# Altium schematic sheet Sensor_Box_RGB_CTRL.SchDoc: Title
size 420 x 297 mm; Author: G.Kasprowicz; CompanyName: WUT ISE; DrawnBy: G.Kasprowicz; Organization: WUT ISE; Address1: PW ISE; Address2: Nowowiejska 15/19 00-665 Warsaw; Address3: gkasprow@gmail.com; Revision: 1.0; SheetNumber: -; SheetTotal: -; ModifiedBy: -; CheckedDate: -; Title2: Title2; DivGrp: WUT ISE; Designer: G.Kasprowicz; ModifiedDate: -; ProjectName: Sensor Box
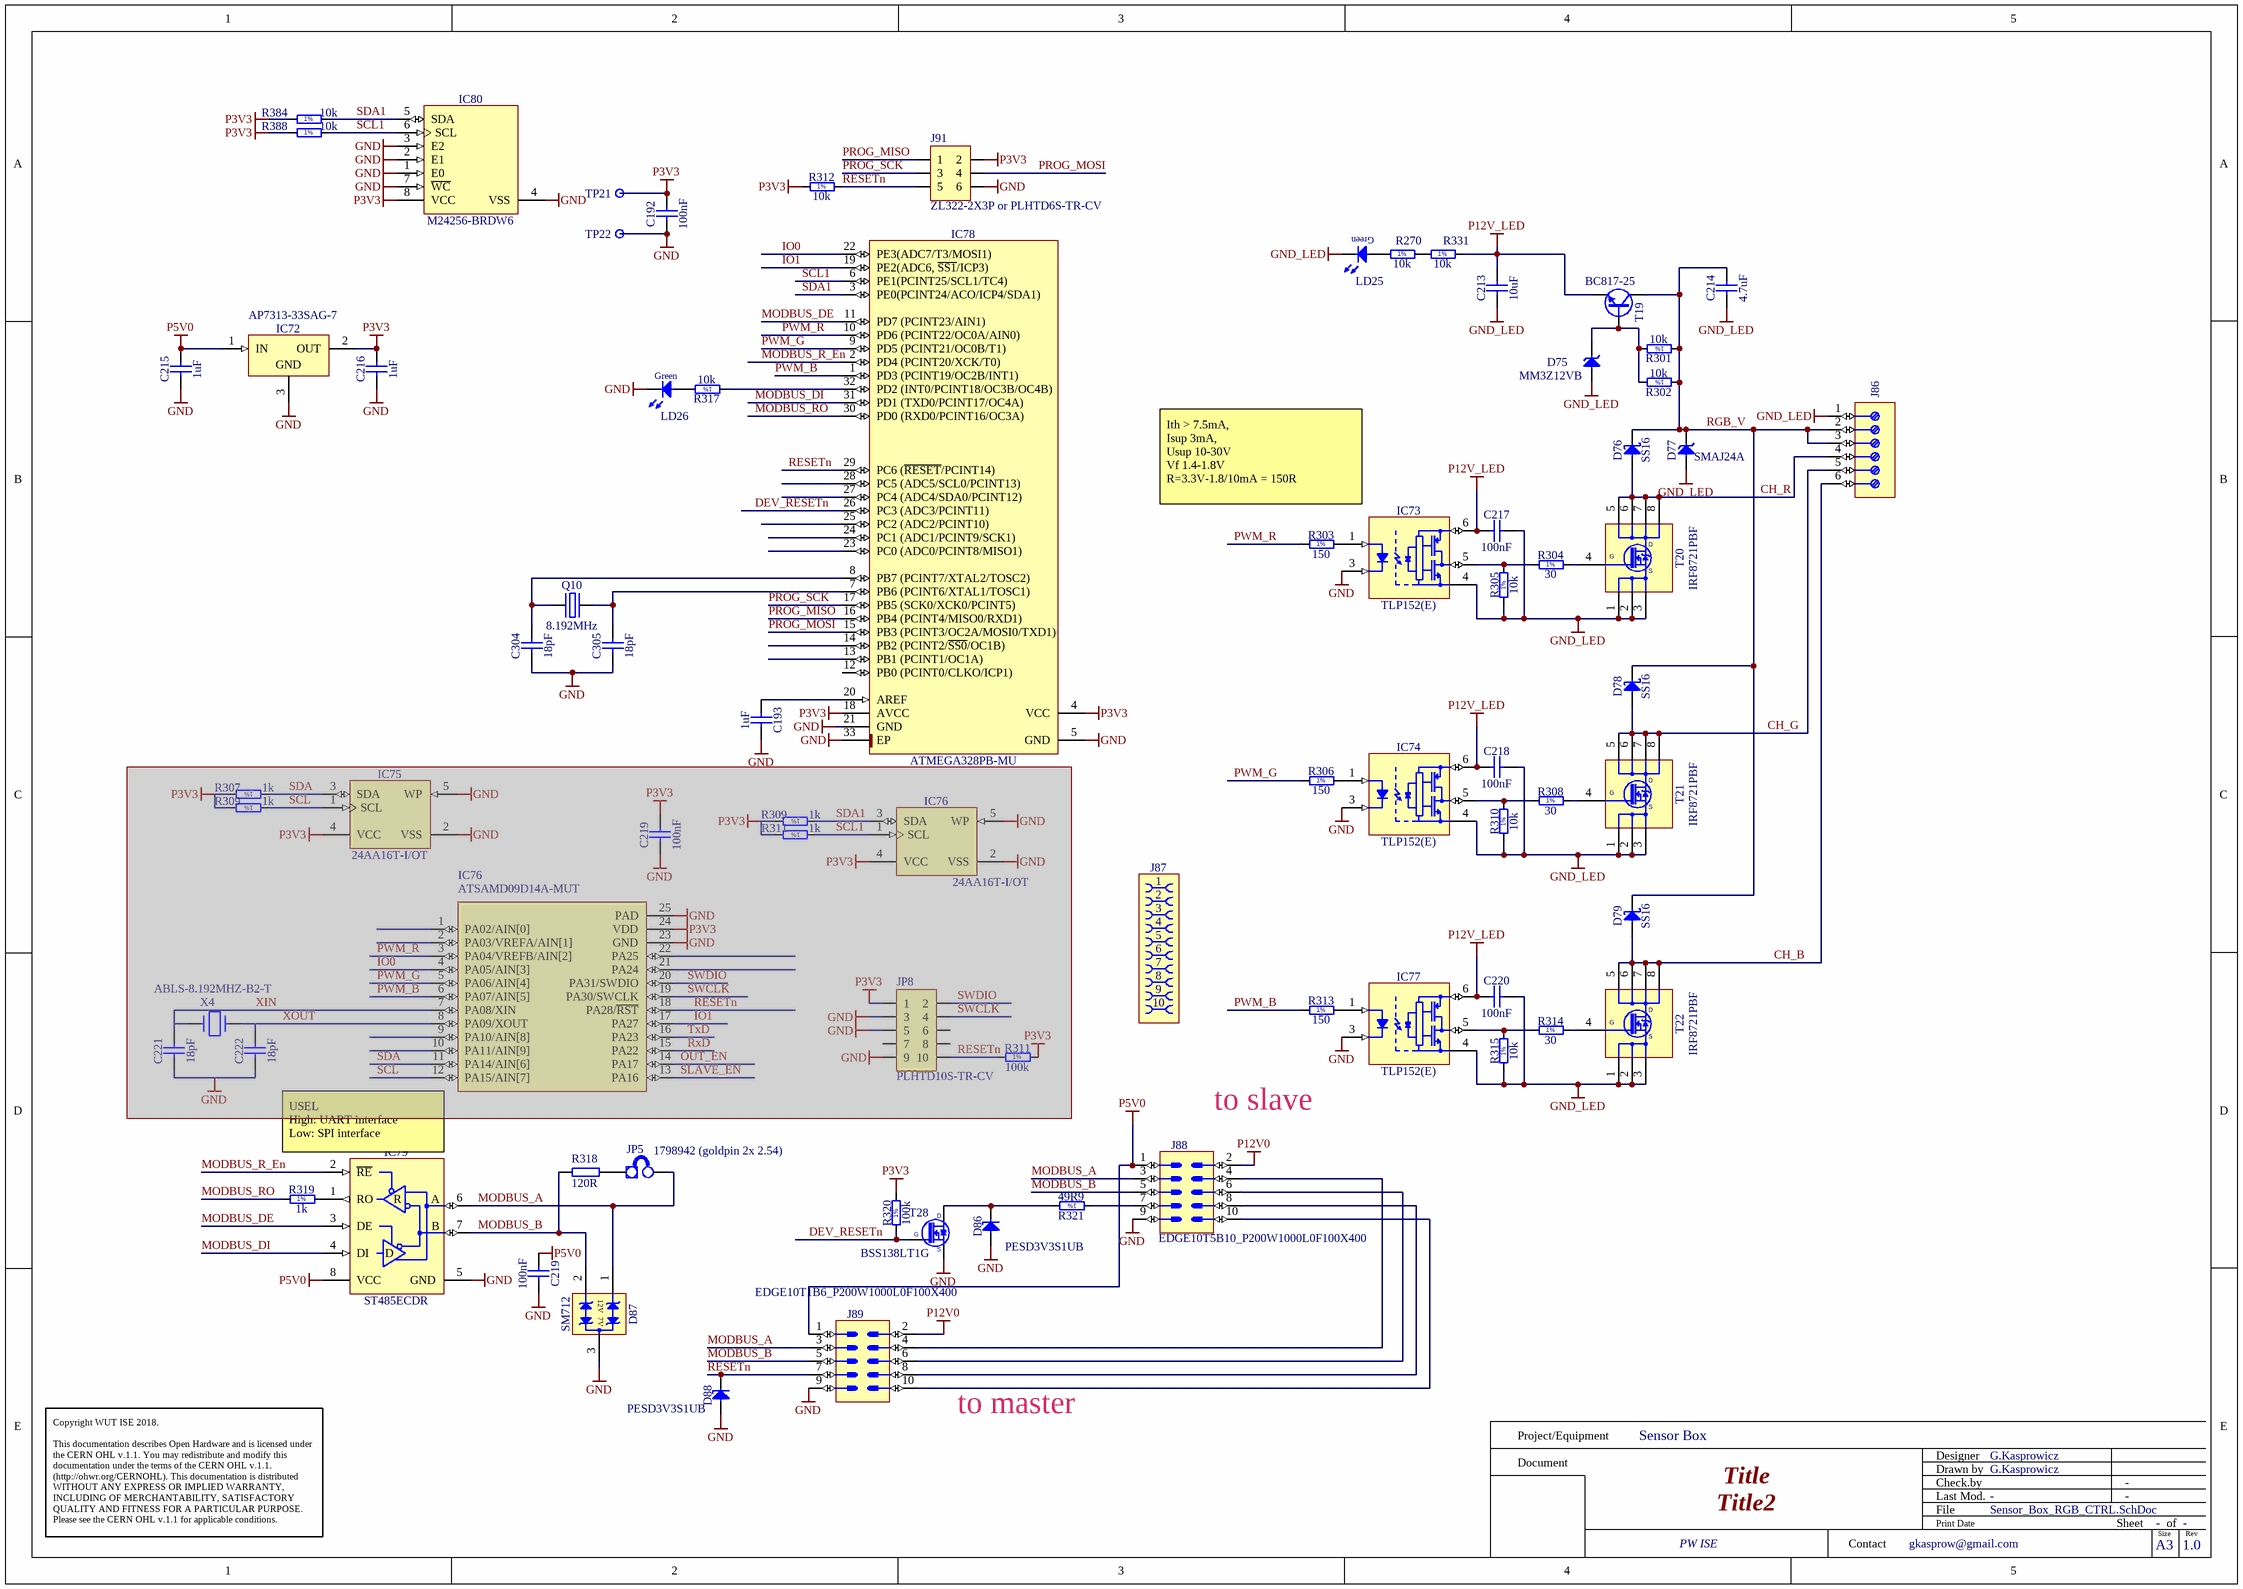
[diagram p0: Sensor_Box_RGB_CTRL.SchDoc]

## Parts
(Parts that share a designator on the sheet are numbered #1, #2 ... from top to bottom, then left to right.)
C192  100nF  [CAPC1005X55N]
C193  1uF  [CAPC1005X55N]
C213  10uF  [CAPC2012X135N]
C214  4.7uF  [CAPC1608X90N]
C215  1uF  [CAPC1005X55N]
C216  1uF  [CAPC1005X55N]
C217  100nF  [CAPC1608X87N]
C218  100nF  [CAPC1608X87N]
C219#1  100nF  [CAPC1005X55N]  (masked out: inside a compile mask, not in the netlist)
C219#2  100nF  [CAPC1005X55N]
C220  100nF  [CAPC1608X87N]
C221  18pF  [CAPC1005X55N]  (masked out: inside a compile mask, not in the netlist)
C222  18pF  [CAPC1005X55N]  (masked out: inside a compile mask, not in the netlist)
C304  18pF  [CAPC1005X55N]
C305  18pF  [CAPC1005X55N]
D75  MM3Z12VB  [SODFL2513X100N]
D76  SS16  [DIOM5127X229N]
D77  SMAJ24A  [DIOM5226X262N]
D78  SS16  [DIOM5127X229N]
D79  SS16  [DIOM5127X229N]
D86  PESD3V3S1UB  [SODFL1608X65N]
D87  SM712  [SOT95P237X112-3N]
D88  PESD3V3S1UB  [SODFL1608X65N]
IC72  AP7313-33SAG-7  [SOT95P240X130-3N]
IC73  TLP152(E)  [SOIC127P700X210-5N]
IC74  TLP152(E)  [SOIC127P700X210-5N]
IC75  24AA16T-I/OT  [SOT95P280X145-5N]  (masked out: inside a compile mask, not in the netlist)
IC76#1  24AA16T-I/OT  [SOT95P280X145-5N]  (masked out: inside a compile mask, not in the netlist)
IC76#2  ATSAMD09D14A-MUT  [QFN50P400X400X80_HS-25N]  (masked out: inside a compile mask, not in the netlist)
IC77  TLP152(E)  [SOIC127P700X210-5N]
IC78  ATMEGA328PB-MU  [QFN50P500X500X100-33N-S325]
IC79  ST485ECDR  [SOIC127P600X175-8N]
IC80  M24256-BRDW6  [SOP65P640X120-8N]
J86  (no value)  [PHOENIX_1751138]
J87  (no value)  [AVX_00 9159 010 061 916]
J88  (no value)  [EDGE10T5B10_P200W1000L0F100X400]
J89  (no value)  [EDGE10T1B6_P200W1000L0F100X400]
J91  ZL322-2X3P or PLHTD6S-TR-CV  [ZL322-2X3P]
JP5  1798942 (goldpin 2x 2.54)  [jump]
JP8  PLHTD10S-TR-CV  [PLHTD10S-TR-CV]  (masked out: inside a compile mask, not in the netlist)
LD25  Green  [LED_KINGBRIGHT_KPTR3216]  (value not drawn)
LD26  Green  [LED_KINGBRIGHT_KPH-1608CGCK]
Q10  8.192MHz  [XTAL_ABRACON_ABLS]
R270  10k  [RESC1005X40N]
R301  10k  [RESC1005X40N]
R302  10k  [RESC1005X40N]
R303  150  [RESC1608X55N]
R304  30  [RESC1608X55N]
R305  10k  [RESC1005X40N]
R306  150  [RESC1608X55N]
R307  1k  [RESC1005X40N]  (masked out: inside a compile mask, not in the netlist)
R308  30  [RESC1608X55N]
R309#1  1k  [RESC1005X40N]  (masked out: inside a compile mask, not in the netlist)
R309#2  1k  [RESC1005X40N]  (masked out: inside a compile mask, not in the netlist)
R310  10k  [RESC1005X40N]
R311#1  1k  [RESC1005X40N]  (masked out: inside a compile mask, not in the netlist)
R311#2  100k  [RESC1005X40N]  (masked out: inside a compile mask, not in the netlist)
R312  10k  [RESC1005X40N]
R313  150  [RESC1608X55N]
R314  30  [RESC1608X55N]
R315  10k  [RESC1005X40N]
R317  10k  [RESC1005X40N]
R318  120R  [1206R]
R319  1k  [RESC1005X40N]
R320  100k  [RESC1005X40N]
R321  49R9  [RESC1005X40N]
R331  10k  [RESC1005X40N]
R384  10k  [RESC1005X40N]
R388  10k  [RESC1005X40N]
T19  BC817-25  [SOT95P230X110-3N]
T20  IRF8721PBF  [SOIC127P600X175-8N]
T21  IRF8721PBF  [SOIC127P600X175-8N]
T22  IRF8721PBF  [SOIC127P600X175-8N]
T28  BSS138LT1G  [SOT95P240X110-3N]
TP21  Test Point  [TPS127]  (value not drawn)
TP22  Test Point  [TPS127]  (value not drawn)
X4  ABLS-8.192MHZ-B2-T  [HC-49SM]  (masked out: inside a compile mask, not in the netlist)

## Nets
GND: C192.1 C193.2 C215.1 C216.1 C219#2.2 C304.1 C305.1 D86.2(A) D87.3(GND) D88.2(A) IC72.3(GND) IC73.3(K) IC74.3(K) IC77.3(K) IC78.5(GND) IC78.21(GND) IC78.33(EP) IC79.5(GND) IC80.1(E0) IC80.2(E1) IC80.3(E2) IC80.4(VSS) IC80.7(~{WC}) J88.9 J89.9 J91.6 LD26.1(C) T28.2(S) TP22.1
GND_LED: C213.1 C214.1 C217.2 C218.2 C220.2 D75.2(A) D77.2(A) IC73.4(VSS) IC74.4(VSS) IC77.4(VSS) J86.1 LD25.1(C) R305.1 R310.1 R315.1 T20.1(S) T20.2(S) T20.3(S) T21.1(S) T21.2(S) T21.3(S) T22.1(S) T22.2(S) T22.3(S)
P3V3: C192.2 C216.2 IC72.2(OUT) IC78.4(VCC) IC78.18(AVCC) IC80.8(VCC) J91.2 R312.1 R320.2 R384.1 R388.1 TP21.1
P5V0: C215.2 C219#2.1 IC72.1(IN) IC79.8(VCC) J88.1 J89.1
P12V0: J88.2 J89.2
P12V_LED: C213.2 C217.1 C218.1 C220.1 IC73.6(VDD) IC74.6(VDD) IC77.6(VDD) R331.2 T19.2(E)
CH_B: D79.2(A) J86.6 T22.5(D) T22.6(D) T22.7(D) T22.8(D)
CH_G: D78.2(A) J86.5 T21.5(D) T21.6(D) T21.7(D) T21.8(D)
CH_R: D76.2(A) J86.4 T20.5(D) T20.6(D) T20.7(D) T20.8(D)
DEV_RESETn: IC78.26(PC3_(ADC3/PCINT11)) R320.1 T28.1(G)
IO0: IC78.22(PE3(ADC7/T3/MOSI1))
IO1: IC78.19(PE2(ADC6,_~{SS1}/ICP3))
MODBUS_A: D87.1(I/O1) IC79.6(A) J88.3 J89.3 JP5.2(E2)
MODBUS_B: D87.2(I/O2) IC79.7(B) J88.5 J89.5 R318.1
MODBUS_DE: IC78.11(PD7_(PCINT23/AIN1)) IC79.3(DE)
MODBUS_DI: IC78.31(PD1_(TXD0/PCINT17/OC4A)) IC79.4(DI)
MODBUS_R_En: IC78.2(PD4_(PCINT20/XCK/T0)) IC79.2(~{RE})
MODBUS_RO: IC78.30(PD0_(RXD0/PCINT16/OC3A)) R319.1
PROG_MISO: IC78.16(PB4_(PCINT4/MISO0/RXD1)) J91.1
PROG_MOSI: IC78.15(PB3_(PCINT3/OC2A/MOSI0/TXD1)) J91.4
PROG_SCK: IC78.17(PB5_(SCK0/XCK0/PCINT5)) J91.3
PWM_B: IC78.1(PD3_(PCINT19/OC2B/INT1)) R313.1
PWM_G: IC78.9(PD5_(PCINT21/OC0B/T1)) R306.1
PWM_R: IC78.10(PD6_(PCINT22/OC0A/AIN0)) R303.1
RESETn: D88.1(C) IC78.29(PC6_(~{RESET}/PCINT14)) J89.7 J91.5 R312.2
RGB_V: C214.2 D76.1(C) D77.1(C) D78.1(C) D79.1(C) J86.2 J86.3 R301.1 R302.1 T19.3(C)
SCL1: IC78.6(PE1(PCINT25/SCL1/TC4)) IC80.6(SCL) R388.2
SDA1: IC78.3(PE0(PCINT24/ACO/ICP4/SDA1)) IC80.5(SDA) R384.2
NetC193_1: C193.1 IC78.20(AREF)
NetC304_2: C304.2 IC78.8(PB7_(PCINT7/XTAL2/TOSC2)) Q10.1(OSC1)
NetC305_2: C305.2 IC78.7(PB6_(PCINT6/XTAL1/TOSC1)) Q10.2(OSC2)
NetD75_1: D75.1(C) R301.2 R302.2 T19.1(B)
NetD86_1: D86.1(C) R321.2 T28.3(D)
NetIC73_1: IC73.1(A) R303.2
NetIC73_5: IC73.5(VO1) R304.1 R305.2
NetIC74_1: IC74.1(A) R306.2
NetIC74_5: IC74.5(VO1) R308.1 R310.2
NetIC77_1: IC77.1(A) R313.2
NetIC77_5: IC77.5(VO1) R314.1 R315.2
NetIC78_32: IC78.32(PD2_(INT0/PCINT18/OC3B/OC4B)) R317.1
NetIC79_1: IC79.1(RO) R319.2
NetJ88_4: J88.4 J89.4
NetJ88_6: J88.6 J89.6
NetJ88_7: J88.7 R321.1
NetJ88_8: J88.8 J89.8
NetJ88_10: J88.10 J89.10
NetJP5_1: JP5.1(E1) R318.2
NetLD25_2: LD25.2(A) R270.1
NetLD26_2: LD26.2(A) R317.2
NetR270_2: R270.2 R331.1
NetR304_2: R304.2 T20.4(S)
NetR308_2: R308.2 T21.4(S)
NetR314_2: R314.2 T22.4(S)

Not connected (* = marked no-connect by the designer): IC78 12(PB0_(PCINT0/CLKO/ICP1)) 13(PB1_(PCINT1/OC1A)) 14(PB2_(PCINT2/~{SS0}/OC1B)) 23(PC0_(ADC0/PCINT8/MISO1)) 24(PC1_(ADC1/PCINT9/SCK1)) 25(PC2_(ADC2/PCINT10)) 27(PC4_(ADC4/SDA0/PCINT12)) 28(PC5_(ADC5/SCL0/PCINT13))

## Notes on the sheet
- Ith > 7.5mA,
  Isup 3mA,
  Usup 10-30V
  Vf 1.4-1.8V
  R=3.3V-1.8/10mA = 150R
- to slave
- USEL
  High: UART interface
  Low: SPI interface
- to master
- Project/Equipment
- Document
- Designer
- Drawn by
- Check.by
- Copyright WUT ISE 2018.
  This documentation describes Open Hardware and is licensed under the CERN OHL v.1.1. You may redistribute and modify this documentation under the terms of the CERN OHL v.1.1. (http://ohwr.org/CERNOHL). This documentation is distributed WITHOUT ANY EXPRESS OR IMPLIED WARRANTY, INCLUDING OF MERCHANTABILITY, SATISFACTORY QUALITY AND FITNESS FOR A PARTICULAR PURPOSE. Please see the CERN OHL v.1.1 for applicable conditions.
- Contact
- File
- Last Mod.
- Print Date
- Sheet
- Size
- A3
- of
- Rev
- (in symbol Q_IRF8721PBF) G
- (in symbol R0402_1K_1%_0.0625W_100PPM) 1%
- (in symbol R0402_10K_1%_0.0625W_100PPM) 1%
- (in symbol R0402_49R9_1%_0.0625W_100PPM) 1%
- (in symbol R0402_100K_1%_0.0625W_100PPM) 1%
- (in symbol R0603_30R_1%_0.1W_100PPM) 1%
- (in symbol R0603_150R_1%_0.1W_100PPM) 1%
- (in symbol SM712) 12V; 7V
- (in symbol ST485ECDR) R; D

## Library data of the parts
C192 C219#1 = CC0402_100NF_16V_10%_X5R: Non-polarised capacitor; Part Description: SMD Multilayer Chip Ceramic Capacitor; Manufacturer: GENERIC; Manufacturer1 Part Number: GRM155R61C104KA88D; Voltage: 16V; TC: X5R; Tolerance: ±10%; Part Number: CC0402_100NF_16V_10%_X5R; Component Kind: Standard; Component Type: Standard; Pin Count: 2; Value: 100nF; Status: None; Manufacturer Part Number: CC0402_100NF_16V_10%_X5R; Case: 0402; Mounted: Yes; Socket: No; SMD: Yes; Sense: No; Manufacturer1 Example: MURATA; Manufacturer1 ComponentHeight: 0.55mm; HelpURL: \\cern.ch\dfs\Applications\Altium\Datasheets\CC0402_X5R_MURATA_GRM.pdf; Author: CERN DEM JLC; CreateDate: 10.12.2013; LatestRevisionDate: 10.12.2013
C193 C215 C216 = CC0402_1UF_16V_10%_X5R: Non-polarised capacitor; Part Description: SMD Multilayer Chip Ceramic Capacitor; Manufacturer: GENERIC; Manufacturer1 Part Number: C1005X5R1C105KT; Voltage: 16V; TC: X5R; Tolerance: ±10%; Part Number: CC0402_1UF_16V_10%_X5R; Component Kind: Standard; Component Type: Standard; Pin Count: 2; Value: 1uF; Status: Preferred; Manufacturer Part Number: CC0402_1UF_16V_10%_X5R; Case: 0402; Mounted: Yes; Socket: No; SMD: Yes; Sense: No; Manufacturer1 Example: TDK; Manufacturer1 ComponentHeight: 0.55mm; HelpURL: \\cern.ch\dfs\Applications\Altium\Datasheets\CC0402_X5R_TDK_C.pdf; Author: CERN DEM JLC; CreateDate: 25.10.2012; LatestRevisionDate: 25.10.2012
C213 = CC0805_10UF_16V_10%_X5R: Non-polarised capacitor; Part Description: SMD Multilayer Chip Ceramic Capacitor; Manufacturer: GENERIC; Manufacturer1 Part Number: C0805C106K4PAC; Voltage: 16V; TC: X5R; Tolerance: ±10%; Part Number: CC0805_10UF_16V_10%_X5R; Component Kind: Standard; Component Type: Standard; Pin Count: 2; Value: 10uF; Status: Preferred; Manufacturer Part Number: CC0805_10UF_16V_10%_X5R; Case: 0805; Mounted: Yes; Socket: No; SMD: Yes; Sense: No; Manufacturer1 Example: KEMET; Manufacturer1 ComponentHeight: 1.4mm; HelpURL: \\cern.ch\dfs\Applications\Altium\Datasheets\CC1206_X5R_KEMET.pdf; Author: CERN DEM JLC; CreateDate: 03.12.2007; LatestRevisionDate: 03.12.2007
C214 = CC0603_4.7UF_25V_10%_X5R: Non-polarised capacitor; Part Description: SMD Multilayer Chip Ceramic Capacitor; Manufacturer: GENERIC; Manufacturer1 Part Number: GRM188R61E475KE11D; Voltage: 25V; TC: X5R; Tolerance: ±10%; Part Number: CC0603_4.7UF_25V_10%_X5R; Component Kind: Standard; Component Type: Standard; Pin Count: 2; Value: 4.7uF; Status: None; Manufacturer Part Number: CC0603_4.7UF_25V_10%_X5R; Case: 0603; Mounted: Yes; Socket: No; SMD: Yes; Sense: No; Manufacturer1 Example: MURATA; Manufacturer1 ComponentHeight: 0.95mm; HelpURL: \\cern.ch\dfs\Applications\Altium\Datasheets\CC0603_MURATA_GRM188R61E475KE11D.pdf; Author: CERN DEM JLC; CreateDate: 10.11.2014; LatestRevisionDate: 10.11.2014
C217 C218 C220 = CC0603_100NF_50V_10%_X5R: Non-polarised capacitor; Part Description: SMD Multilayer Chip Ceramic Capacitor; Manufacturer: GENERIC; Manufacturer1 Part Number: C1608X5R1H104K080AA; Voltage: 50V; TC: X5R; Tolerance: ±10%; Part Number: CC0603_100NF_50V_10%_X5R; Component Kind: Standard; Component Type: Standard; Pin Count: 2; Value: 100nF; Status: None; Manufacturer Part Number: CC0603_100NF_50V_10%_X5R; Case: 0603; Mounted: Yes; Socket: No; SMD: Yes; Sense: No; Manufacturer1 Example: TDK; Manufacturer1 ComponentHeight: 0.9mm; HelpURL: \\cern.ch\dfs\Applications\Altium\Datasheets\CC0603_X5R_TDK_C.pdf; Author: CERN DEM MR; CreateDate: 08.01.2016; LatestRevisionDate: 08.01.2016
C219#2 = CC0402_100NF_16V_10%_X7R: Non-polarised capacitor; Part Description: SMD Multilayer Chip Ceramic Capacitor; Manufacturer: GENERIC; Manufacturer1 Part Number: GRM155R71C104KA88D; Voltage: 16V; TC: X7R; Tolerance: ±10%; Part Number: CC0402_100NF_16V_10%_X7R; Component Kind: Standard; Component Type: Standard; Pin Count: 2; Value: 100nF; Status: Not Recommended; Manufacturer Part Number: CC0402_100NF_16V_10%_X7R; Case: 0402; Mounted: Yes; Socket: No; SMD: Yes; Manufacturer1 Example: MURATA; Manufacturer1 ComponentHeight: 0.55mm; HelpURL: \\cern.ch\dfs\Applications\Altium\Datasheets\CC0402_X7R_MURATA_GRM.pdf; Author: CERN DEM JLC; CreateDate: 05.12.2013; LatestRevisionDate: 03.12.2007; Sense: No
C221 C222 C304 C305 = CC0402_18PF_50V_5%_C0G: Non-polarised capacitor; Part Description: SMD Multilayer Chip Ceramic Capacitor; Manufacturer: GENERIC; Manufacturer1 Part Number: C0402C180J5GACTU; Voltage: 50V; TC: C0G/NP0; Tolerance: ±5%; Part Number: CC0402_18PF_50V_5%_C0G; Component Kind: Standard; Component Type: Standard; Pin Count: 2; Value: 18pF; Status: Preferred; Manufacturer Part Number: CC0402_18PF_50V_5%_C0G; Case: 0402; Mounted: Yes; Socket: No; SMD: Yes; Sense: No; Manufacturer1 Example: KEMET; Manufacturer1 ComponentHeight: 0.55mm; HelpURL: \\cern.ch\dfs\Applications\Altium\Datasheets\CC0805_C0G_KEMET_(Commercial Grade).pdf; Author: CERN DEM JLC; CreateDate: 04.10.2016; LatestRevisionDate: 04.10.2016
D75 = MM3Z12VB: Zener Diode; Part Description: Zener Voltage Regulator; Manufacturer: ON SEMICONDUCTOR; Voltage: 12V; Power: 200mW; PressFit: No; Bonding: No; Part Number: MM3Z12VB; Component Kind: Standard; Component Type: Standard; Device: MM3Z12VB; PackageDescription: SODFL Diode (SOD-323F), 1.70mm W X 1.30mm L X 1.00mm H body, IPC Medium Density; Manufacturer Part Number: MM3Z12VB; Pin Count: 2; Case: SOD-323F; Mounted: Yes; Socket: No; SMD: Yes; Sense: No; ComponentHeight: 1mm; HelpURL: \\cern.ch\dfs\Applications\Altium\Datasheets\MM3Z12VB.pdf; Author: CERN DEM MR; CreateDate: 19.02.2018; LatestRevisionDate: 19.02.2018
D76 D78 D79 = SS16: Schottky Diode; Part Description: Surface Mount Schottky Barrier Rectifier; Manufacturer: VISHAY GENERAL SEMICONDUCTOR; Voltage: 60V; Power: 1A; PressFit: No; Bonding: No; Part Number: SS16; Component Kind: Standard; Component Type: Standard; Device: SS16; PackageDescription: DO-214-AC Molded Diode, Body 5.1x2.7mm, IPC Medium Density; Manufacturer Part Number: SS16; Pin Count: 2; Case: DO-214AC; Mounted: Yes; Socket: No; SMD: Yes; Sense: No; ComponentHeight: 2.29mm; HelpURL: \\cern.ch\dfs\Applications\Altium\Datasheets\SS16.pdf; Author: CERN DEM JLC; CreateDate: 15.07.2008; LatestRevisionDate: 23.08.2010
D77 = SMAJ24A: Transient Voltage Suppressor Diode (Uni-Directional); Part Description: Surface Mount Uni-directional Transient Voltage Suppressor Diode; Manufacturer: BOURNS; Voltage: 24V; Power: 400W; PressFit: No; Bonding: No; Part Number: SMAJ24A; Component Kind: Standard; Component Type: Standard; Device: SMAJ24A; PackageDescription: DO-214-AC/SMA Diode, Molded Body; 5.21mm L X 2.605mm W X 2.62mm H, IPC Medium Density; Manufacturer Part Number: SMAJ24A; Pin Count: 2; Case: DO-214AC; Mounted: Yes; Socket: No; SMD: Yes; Sense: No; ComponentHeight: 2.62mm; HelpURL: \\cern.ch\dfs\Applications\Altium\Datasheets\SMAJ24A.pdf; Author: CERN DEM JLC; CreateDate: 27.06.2011; LatestRevisionDate: 27.06.2011
D86 D88 = PESD3V3S1UB: ESD protection diode; Part Description: ESD protection diode (23kV); Manufacturer: NXP SEMICONDUCTORS; Voltage: 3V3; Power: 330W; PressFit: No; Bonding: No; Part Number: PESD3V3S1UB; Component Kind: Standard; Component Type: Standard; Device: PESD3V3S1UB; PackageDescription: Ultra Small Outline Diode Flat Lead (SOD-523), Body; 1.2mm L X 0.8mm W X 0.65mm H, IPC Medium Density; Manufacturer Part Number: PESD3V3S1UB; Pin Count: 2; Case: SOD523; Mounted: Yes; Socket: No; SMD: Yes; Sense: No; ComponentHeight: 0.65mm; HelpURL: \\cern.ch\dfs\Applications\Altium\Datasheets\PESD3V3S1UB.pdf; Author: CERN DEM JLC; CreateDate: 29.11.2012; LatestRevisionDate: 29.11.2012
D87 = SM712: Asymmetrical TVS Diode for Extended Common-Mode RS-485; Manufacturer: SEMTECH; Voltage: 12V/-7V; Power: 400W; PressFit: No; Bonding: No; Part Number: SM712; Component Kind: Standard; Component Type: Standard; Device: SM712; PackageDescription: SOT, 0.95mm, pitch; 3 pin,1.30mm W X 2.92mm L X 1.12mm H body, IPC Medium Density; Status: Obsolete; Part Description: Asymmetrical TVS Diode for Extended Common-Mode RS-485; Manufacturer Part Number: SM712; Pin Count: 3; Case: SOT-23; Mounted: Yes; Socket: No; SMD: Yes; Sense: No; ComponentHeight: 1.12mm; HelpURL: \\cern.ch\dfs\Applications\Altium\Datasheets\SM712.pdf; Author: CERN DEM JLC; CreateDate: 23.04.2012; LatestRevisionDate: 23.04.2012
IC72 = AP7313-33SAG-7: 3-Terminal Regulator 1=IN 2=OUT 3=GND; Part Description: 3.3V, 150mA Low Quiescent Current, Fast Transient Low Dropout Linear Regulator; Manufacturer: DIODES INCORPORATED; PressFit: No; Bonding: No; Part Number: AP7313-33SAG-7; Component Kind: Standard; Component Type: Standard; Device: AP7313-33SAG-7; PackageDescription: SOT23 3-Leads, Pitch 0.95mm - Body 1.3x2.9mm, IPC Medium Density; Manufacturer Part Number: AP7313-33SAG-7; Pin Count: 3; Case: SOT23; Mounted: Yes; Socket: No; SMD: Yes; Sense: No; ComponentHeight: 1.35mm; HelpURL: \\cern.ch\dfs\Applications\Altium\Datasheets\AP7313-33SAG-7.pdf; Author: CERN DEM JLC; CreateDate: 20.03.2018; LatestRevisionDate: 20.03.2018
IC73 IC74 IC77 = OPTO_TLP152: Optocoupler; Part Description: 2.5A Output Current, High Speed MOSFET Gate Driver Optocoupler; Manufacturer: Toschiba; PressFit: No; Bonding: No; Part Number: TLP152(E); Component Kind: Standard; Component Type: Standard; Device: TLP152(E); PackageDescription: SOIC, 5-Leads, Body 3.70x4.55mm, Pitch 1.27mm, IPC Medium Density; Manufacturer Part Number: TLP152(E); Pin Count: 5; Case: SOIC5; Mounted: Yes; Socket: No; SMD: Yes; Sense: No; ComponentHeight: 5.08mm; HelpURL: \\cern.ch\dfs\Applications\Altium\Datasheets\FOD3182SDV.pdf; Author: GK; CreateDate: 20.10.2014; LatestRevisionDate: 20.10.2014
IC75 IC76#1 = MEM_24AA16T_SOT23: 1.7V-5.5V, 2K I2C Serial EEPROM With EUI-48 Node Identity; Part Description: 1.7V-5.5V, 16K I2C Serial EEPROM; Manufacturer: MICROCHIP TECHNOLOGY; PressFit: No; Bonding: No; Part Number: 24AA16T-I/OT; Component Kind: Standard; Component Type: Standard; Device: 24AA16T-I/OT; PackageDescription: SOT, 0.95mm pitch; 5 pin, 1.60mm W X 2.90mm L X 1.45mm H body, IPC Medium Density; Manufacturer Part Number: 24AA16T-I/OT; Pin Count: 5; Case: SOT23-5; Mounted: Yes; Socket: No; SMD: Yes; Sense: No; ComponentHeight: 1.45mm; HelpURL: \\cern.ch\dfs\Applications\Altium\Datasheets\24AA02E48T-I-OT.pdf; Author: GK; CreateDate: 31.03.2016; LatestRevisionDate: 31.03.2016
IC76#2 = UPC_ATSAMD09D: 32-bit ARM®-based Cortex®-M4 core Microcontroller, 1.62V to 3.6V, 120MHz, 256KB Flash, 64KB of SRAM, 48 QFP, Industrial Grade (-40°C to 85°C); Part Description: ATSAMD09D14A-MUT  SMART SAMD09, SMART ARM based Microcontrollers, 32 bity, 48 MHz, 16 KB, 4 KB; Manufacturer: Microchip; PressFit: No; Bonding: No; Part Number: ATSAMD09D14A-MUT; Component Kind: Standard; Component Type: Standard; Device: ATSAMD09D14A-MUT; PackageDescription: QFN, 24-Leads, Body 4.00x4.00mm, Pitch 0.50mm, Thermal Pad 2.60x2.60mm, IPC Medium Density; Manufacturer Part Number: ATSAMD09D14A-MUT; Pin Count: 24; Case: QFN24; Mounted: Yes; Socket: No; SMD: Yes; Sense: No; ComponentHeight: 1.6mm; HelpURL: \\cern.ch\dfs\Applications\Altium\Datasheets\ATSAM4S4AA-AU.pdf; Author: GK; CreateDate: 16.12.2017; LatestRevisionDate: 16.12.2017
IC78 = UPC_ATMEGA328PB-MU: 8-bit AVR 20MHz Microcontroller With 32K Bytes In-System  Programmable  Flash; Part Description: 8-bit AVR Microcontroller, 32KB Flash, 1KB EEPROM, 2KB SRAM, 32-pin MLF, Industrial Grade (-40°C to 85°C); Manufacturer: ATMEL; PressFit: No; Bonding: No; Part Number: ATMEGA328PB-MU; Component Kind: Standard; Component Type: Standard; Device: ATMEGA328PB-MU; PackageDescription: QFN, (MO-220-VHHD-2) 0.50mm pitch,square; 8 pin X 8 pin, 5mm X 5mm X 1.00mm H body (w/thermal tab 3.25 X 3.25mm),  IPC Medium Density; Manufacturer Part Number: ATMEGA328PB-MU; Pin Count: 33; Case: QFN32; Mounted: Yes; Socket: No; SMD: Yes; Sense: No; ComponentHeight: 1mm; HelpURL: \\cern.ch\dfs\Applications\Altium\Datasheets\ATMEGA328P-MU.pdf; Author: GK; CreateDate: 2011-02-08; LatestRevisionDate: 2014-07-02
IC79 = ST485ECDR: ±15kV ESD-Protected, Low Power  RS-485/RS-422 Transceiver; Manufacturer: ST MICROELECTRONICS; PressFit: No; Bonding: No; Part Number: ST485ECDR; Component Kind: Standard; Component Type: Standard; Device: ST485ECDR; PackageDescription: SOIC 8, Pitch 1.27mm - Body 4x5mm, IPC Medium Density; Part Description: ±15kV ESD-Protected, Low Power  RS-485/RS-422 Transceiver; Manufacturer Part Number: ST485ECDR; Pin Count: 8; Case: SOIC8; Mounted: Yes; Socket: No; SMD: Yes; Sense: No; ComponentHeight: 1.75mm; Author: CERN DEM MR; HelpURL: \\cern.ch\dfs\Applications\Altium\Datasheets\ST485ECDR.pdf; CreateDate: 15.02.2018; LatestRevisionDate: 15.02.2018
IC80 = MEM_M24256-BRDW6P: 256-Kbit Serial I²C Bus EEPROM; Manufacturer: ST MICROELECTRONICS; PressFit: No; Bonding: No; Part Number: M24256-BRDW6P; Component Kind: Standard; Component Type: Standard; Device: M24256-BRDW6; PackageDescription: SOP, 0.65mm pitch; 8 pin, 4.40mm W X 3.00mm L X 1.20mm H body, IPC Medium Density; Part Description: 256-Kbit Serial I²C Bus EEPROM; Manufacturer Part Number: M24256-BRDW6; Pin Count: 8; Case: TSSOP8; Mounted: Yes; Socket: No; SMD: Yes; Sense: No; ComponentHeight: 1.2mm; HelpURL: \\cern.ch\dfs\Applications\Altium\Datasheets\M24256-BRDW6P.pdf; Author: CERN DEM MR; CreateDate: 17.03.2016; LatestRevisionDate: 17.03.2016
J86 = PHOENIX_1751138: Terminal Block, 6 Positions, Screw Connection; Part Description: 10A 200V PCB Terminal Block, Pitch 3.5mm, 6 Positions, Screw Connection (Conductor/PCB connection direction: 55°); Manufacturer: PHOENIX CONTACT; Manufacturer Part Number: 1751138 (SMKDS 1/ 6-3,5); PressFit: No; Part Number: PHOENIX_1751138; Component Kind: Standard; Component Type: Standard; Pin Count: 6; Mounted: Yes; Socket: No; SMD: No; Sense: No; Status: None; ComponentHeight: 9.5mm; HelpURL: \\cern.ch\dfs\Applications\Altium\Datasheets\PHOENIX_1751138.pdf; Author: CERN DEM JLC; CreateDate: 31.03.2015; LatestRevisionDate: 31.03.2015
J87 = AVX_00 9159 010 061 916: Open Ended Card Edge Connector, 9159 Series; Part Description: 10 Contacts, 2mm Pitch, Open Ended Card Edge Connector, 9159 Series; Manufacturer: AVX; PressFit: No; Part Number: AVX_00 9159 010 061 916; Component Kind: Standard; Component Type: Standard; Pin Count: 10; Mounted: Yes; Socket: No; SMD: No; Sense: No; Status: None; Manufacturer Part Number: 00 9159 010 061 916; ComponentHeight: 1.6mm; HelpURL: \\cern.ch\dfs\Applications\Altium\Datasheets\AVX_00 9159 010 061 916.pdf; Author: CERN DEM MR; CreateDate: 13.02.2018; LatestRevisionDate: 13.02.2018
J88 = EDGE10T5B10_P200W1000L0F100X400: PCB Edge Connector 10 (2x5); Part Description: 10 Contacts Board Edge Connector, Pitch 2mm, Length 0mm, Width 10mm, Finger Lenght 4mm, Finger Width 1mm; Mounted: No; PressFit: No; Part Number: EDGE10T5B10_P200W1000L0F100X400; Component Kind: Standard (No BOM); Component Type: Standard (No BOM); Pin Count: 10; Socket: No; SMD: No; Sense: No; Status: None; ComponentHeight: 0mm; HelpURL: \\cern.ch\dfs\Applications\Altium\Datasheets\EDGE10T5B10_P200W1000L0F100X400.pdf; Author: CERN DEM MR; CreateDate: 14.02.2018; LatestRevisionDate: 14.02.2018
J89 = EDGE10T1B6_P200W1000L0F100X400: PCB Edge Connector 10 (2x5); Part Description: 10 Contacts Board Edge Connector, Pitch 2mm, Length 0mm, Width 10mm, Finger Lenght 4mm, Finger Width 1mm; Mounted: No; PressFit: No; Part Number: EDGE10T1B6_P200W1000L0F100X400; Component Kind: Standard (No BOM); Component Type: Standard (No BOM); Pin Count: 10; Socket: No; SMD: No; Sense: No; Status: None; ComponentHeight: 0mm; HelpURL: \\cern.ch\dfs\Applications\Altium\Datasheets\EDGE10T1B6_P200W1000L0F100X400.pdf; Author: CERN DEM MR; CreateDate: 14.02.2018; LatestRevisionDate: 14.02.2018
J91 = CON_2x3 1.27 SMT Male: 1.27 mm dual row goldpin (Maritex)
JP5 = JUMPER: Supplier 1: Farnell; Supplier Part Number 1: 1798942
JP8 = CON_2x5 1.27 SMT Male: 1.27 mm dual row goldpin (Maritex)
LD25 = LED_KINGBRIGHT_KPTR-3216CGCK: LED Green 1A 2C; Part Description: Reverse Mount LED 1.4x1.6mm Green; PressFit: No; Bonding: No; Part Number: LED_KINGBRIGHT_KPTR-3216CGCK; Component Kind: Standard; Component Type: Standard; Color: Green; PackageDescription: Reverse Mount LED 3216, Hole 2.1x2.3mm 0.35mm Height; Manufacturer: KINGBRIGHT; Manufacturer Part Number: KPTR-3216CGCK; Pin Count: 2; Mounted: Yes; Socket: No; SMD: Yes; Sense: No; ComponentHeight: 0.35mm; HelpURL: \\cern.ch\dfs\Applications\Altium\Datasheets\LED_KINGBRIGHT_KPTR-3216CGCK.pdf; Author: CERN DEM MR; CreateDate: 15.02.2016; LatestRevisionDate: 15.02.2016
LD26 = LED_KINGBRIGHT_KPH-1608CGCK: LED Green 1C 2A; Part Description: SMD Green LED, Case 1.6mmX0.8mm(0603), 0.65mm Thickness; PressFit: No; Bonding: No; Part Number: LED_KINGBRIGHT_KPH-1608CGCK; Component Kind: Standard; Component Type: Standard; Color: Green; PackageDescription: SMT Green LED, Case 0603, Body L 1.6 x W 0.8mm H 0.65mm; Manufacturer: KINGBRIGHT; Manufacturer Part Number: KPH-1608CGCK; Pin Count: 2; Mounted: Yes; Socket: No; SMD: Yes; Sense: No; ComponentHeight: 0.65mm; HelpURL: \\cern.ch\dfs\Applications\Altium\Datasheets\LED_KINGBRIGHT_KPH-1608CGCK.pdf; Author: CERN DEM JLC; CreateDate: 03.07.2017; LatestRevisionDate: 03.07.2017
Q10 = XTAL_8.192MHZ_ABRACON_ABLS-8.192MHZ-B2-T: Quartz Crystal; Part Description: Tolerance: ± 20ppm, Stability: ± 50ppm, -20°C to +70°C, 18pF, 80 Ohms ESR, Low Profile Surface Mount Microprocessor Crystal, ABLS Series; PressFit: No; Bonding: No; Part Number: XTAL_8.192MHZ_ABRACON_ABLS-8.192MHZ-B2-T; Component Kind: Standard; Component Type: Standard; PackageDescription: SMD Crystal, Body 11.40mm L X 4.70mm W X 4.20mm H, HC/49US (AT49) ALBS Series; Value: 8.192MHz; Manufacturer: ABRACON; Manufacturer Part Number: ABLS-8.192MHZ-B2-T; Pin Count: 2; Mounted: Yes; Socket: No; SMD: Yes; Sense: No; ComponentHeight: 4.2mm; HelpURL: \\cern.ch\dfs\Applications\Altium\Datasheets\XTAL_ABRACON_ABLS.pdf; Author: CERN DEM MR; CreateDate: 15.02.2018; LatestRevisionDate: 15.02.2018
R270 R301 R302 R305 R310 R312 R315 R317 R331 R384 R388 = R0402_10K_1%_0.0625W_100PPM: Resistor - 1%; Part Description: General Purpose Thick Film Chip Resistor; Manufacturer: GENERIC; Manufacturer1 Part Number: 232270671003L; TC: ±100ppm/°C; PressFit: No; Part Number: R0402_10K_1%_0.0625W_100PPM; Component Kind: Standard; Component Type: Standard; Pin Count: 2; Value: 10k; Status: Not Recommended; Power: 0.0625W; Tolerance: ±1%; Manufacturer Part Number: R0402_10K_1%_0.0625W_100PPM; Case: 0402; Mounted: Yes; Sense: No; Socket: No; SMD: Yes; Manufacturer1 Example: YAGEO PHYCOMP; Manufacturer1 ComponentHeight: 0.4mm; HelpURL: \\cern.ch\dfs\Applications\Altium\Datasheets\R0402_Phycomp_RC0402.pdf; Author: CERN DEM JLC; CreateDate: 03.12.2007; LatestRevisionDate: 17.10.2012
R303 R306 R313 = R0603_150R_1%_0.1W_100PPM: Resistor - 1%; Part Description: General Purpose Thick Film Chip Resistor; Manufacturer: GENERIC; Manufacturer1 Part Number: NRC06F1500TRF; Power: 0.1W; TC: ±100ppm/°C; PressFit: No; Part Number: R0603_150R_1%_0.1W_100PPM; Component Kind: Standard; Component Type: Standard; Pin Count: 2; Value: 150; Status: Preferred; Tolerance: ±1%; Manufacturer Part Number: R0603_150R_1%_0.1W_100PPM; Case: 0603; Mounted: Yes; Sense: No; Socket: No; SMD: Yes; Manufacturer1 Example: NIC COMPONENT; Manufacturer1 ComponentHeight: 0.55mm; HelpURL: \\cern.ch\dfs\Applications\Altium\Datasheets\R0603_NIC_NRC.pdf; Author: CERN DEM JLC; CreateDate: 03.12.2007; LatestRevisionDate: 13.03.2008
R304 R308 R314 = R0603_30R_1%_0.1W_100PPM: Resistor - 1%; Part Description: General Purpose Thick Film Chip Resistor; Manufacturer: GENERIC; Manufacturer1 Part Number: NRC06F30R0TRF; Power: 0.1W; TC: ±100ppm/°C; PressFit: No; Part Number: R0603_30R_1%_0.1W_100PPM; Component Kind: Standard; Component Type: Standard; Pin Count: 2; Value: 30; Status: Preferred; Tolerance: ±1%; Manufacturer Part Number: R0603_30R_1%_0.1W_100PPM; Case: 0603; Mounted: Yes; Sense: No; Socket: No; SMD: Yes; Manufacturer1 Example: NIC COMPONENT; Manufacturer1 ComponentHeight: 0.55mm; HelpURL: \\cern.ch\dfs\Applications\Altium\Datasheets\R0603_NIC_NRC.pdf; Author: CERN DEM JLC; CreateDate: 03.12.2007; LatestRevisionDate: 13.03.2008
R307 R309#1 R309#2 R311#1 R319 = R0402_1K_1%_0.0625W_100PPM: Resistor - 1%; Part Description: General Purpose Thick Film Chip Resistor; Manufacturer: GENERIC; Manufacturer1 Part Number: 232270671002L; TC: ±100ppm/°C; PressFit: No; Part Number: R0402_1K_1%_0.0625W_100PPM; Component Kind: Standard; Component Type: Standard; Pin Count: 2; Value: 1k; Status: Not Recommended; Power: 0.0625W; Tolerance: ±1%; Manufacturer Part Number: R0402_1K_1%_0.0625W_100PPM; Case: 0402; Mounted: Yes; Sense: No; Socket: No; SMD: Yes; Manufacturer1 Example: YAGEO PHYCOMP; Manufacturer1 ComponentHeight: 0.4mm; HelpURL: \\cern.ch\dfs\Applications\Altium\Datasheets\R0402_Phycomp_RC0402.pdf; Author: CERN DEM JLC; CreateDate: 03.12.2007; LatestRevisionDate: 17.10.2012
R311#2 R320 = R0402_100K_1%_0.0625W_100PPM: Resistor - 1%; Part Description: General Purpose Thick Film Chip Resistor; Manufacturer: GENERIC; Manufacturer1 Part Number: 232270671004L; TC: ±100ppm/°C; PressFit: No; Part Number: R0402_100K_1%_0.0625W_100PPM; Component Kind: Standard; Component Type: Standard; Pin Count: 2; Value: 100k; Status: Not Recommended; Power: 0.0625W; Tolerance: ±1%; Manufacturer Part Number: R0402_100K_1%_0.0625W_100PPM; Case: 0402; Mounted: Yes; Sense: No; Socket: No; SMD: Yes; Manufacturer1 Example: YAGEO PHYCOMP; Manufacturer1 ComponentHeight: 0.4mm; HelpURL: \\cern.ch\dfs\Applications\Altium\Datasheets\R0402_Phycomp_RC0402.pdf; Author: CERN DEM JLC; CreateDate: 03.12.2007; LatestRevisionDate: 17.10.2012
R318 = RES_1206: SMD Resistor; Supplier 1: Newark; Supplier Part Number 1: 39K0871
R321 = R0402_49R9_1%_0.0625W_100PPM: Resistor - 1%; Part Description: General Purpose Thick Film Chip Resistor; Manufacturer: GENERIC; Manufacturer1 Part Number: 232270674999L or RC0402FR-0749R9L; TC: ±100ppm/°C; Table: Resistors SMD; Part Number: R0402_49R9_1%_0.0625W_100PPM; Component Kind: Standard; Component Type: Standard; Pin Count: 2; Value: 49R9; Status: Not recommended; Power: 0.0625W; Tolerance: ±1%; Manufacturer Part Number: R0402_49R9_1%_0.0625W_100PPM; Case: 0402; Mounted: Yes; Socket: No; SMD: Yes; Manufacturer1 Example: YAGEO PHYCOMP; Manufacturer1 ComponentHeight: 0.4mm; HelpURL: \\cern.ch\dfs\Applications\Altium\Datasheets\R0402_Phycomp_RC0402.pdf; Author: CERN DEM JLC; CreateDate: 2012-10-24; LatestRevisionDate: 2012-10-24
T19 = BC817-25: NPN Transistor; Part Description: 45V 500mA NPN General-Purpose Transistor; Manufacturer: NXP SEMICONDUCTORS; PressFit: No; Bonding: No; Part Number: BC817-25; Component Kind: Standard; Component Type: Standard; Device: BC817-25; PackageDescription: SOT23, 3 pin, Pitch 0.95mm - 1.3mm W X 2.9mm L X 1.1mm H, IPC Medium Density; Manufacturer Part Number: BC817-25; Pin Count: 3; Case: SOT23-3; Mounted: Yes; Socket: No; SMD: Yes; Sense: No; ComponentHeight: 1.1mm; HelpURL: \\cern.ch\dfs\Applications\Altium\Datasheets\BC817-25.pdf; Author: CERN DEM JLC; CreateDate: 28.10.2014; LatestRevisionDate: 28.10.2014
T20-T22 = Q_IRF8721PBF: 30V 11A N-Channel HEXFET® Power MOSFET; Manufacturer: INTERNATIONAL RECTIFIER; PressFit: No; Bonding: No; Part Number: IRF8721PBF; Component Kind: Standard; Component Type: Standard; Device: IRF8721PBF; PackageDescription: SOIC 8, Pitch 1.27mm - Body 4x5mm, IPC Medium Density; Part Description: 30V 11A N-Channel HEXFET® Power MOSFET; Manufacturer Part Number: IRF8721PBF; Pin Count: 8; Case: SOIC8; Mounted: Yes; Socket: No; SMD: Yes; Sense: No; ComponentHeight: 1.75mm; HelpURL: \\cern.ch\dfs\Applications\Altium\Datasheets\IRF7413PBF.pdf; Author: GK; CreateDate: 28.04.2011; LatestRevisionDate: 28.04.2011
T28 = BSS138LT1G: N-CHANNEL MOSFET WITH DIODE; Part Description: 50V 200mA N-Channel Enhancement Mode Field-Effect Transistor; Manufacturer: ON SEMICONDUCTOR; PressFit: No; Bonding: No; Part Number: BSS138LT1G; Component Kind: Standard; Component Type: Standard; Device: BSS138LT1G; PackageDescription: SOT23 3-Leads, Pitch 0.95mm - Body 1.4x3mm, IPC Medium Density; Manufacturer Part Number: BSS138LT1G; Pin Count: 3; Case: SOT23-3; Mounted: Yes; Socket: No; SMD: Yes; Sense: No; ComponentHeight: 1.11mm; HelpURL: \\cern.ch\dfs\Applications\Altium\Datasheets\BSS138LT1G.pdf; Author: CERN DEM JLC; CreateDate: 23.03.2009; LatestRevisionDate: 23.03.2009
TP21 TP22 = SMD_PAD_1.27X1.27MM: Part Description: 1.27mm x 1.27mm PCB Copper Area (SMD Test Point); Mounted: No; Part Number: SMD_PAD_1.27X1.27MM; Component Kind: Standard (No BOM); Component Type: Standard (No BOM); Pin Count: 1; Family: Test Point; Socket: No; SMD: Yes; Sense: No; Status: None; ComponentHeight: 0mm; HelpURL: Undefined; Author: CERN DEM JLC; CreateDate: 12.01.2008; LatestRevisionDate: 12.01.2008; PackageDescription: 1.27mm x 1.27mm PCB Copper Area (SMD Test Point)
X4 = X_CRYSTAL_HC49_SMT: Crystal oscillator; Supplier 1: Newark; Supplier Part Number 1: 56P2843